# EAGLE design placa_nano (EAGLE 7.7.0)
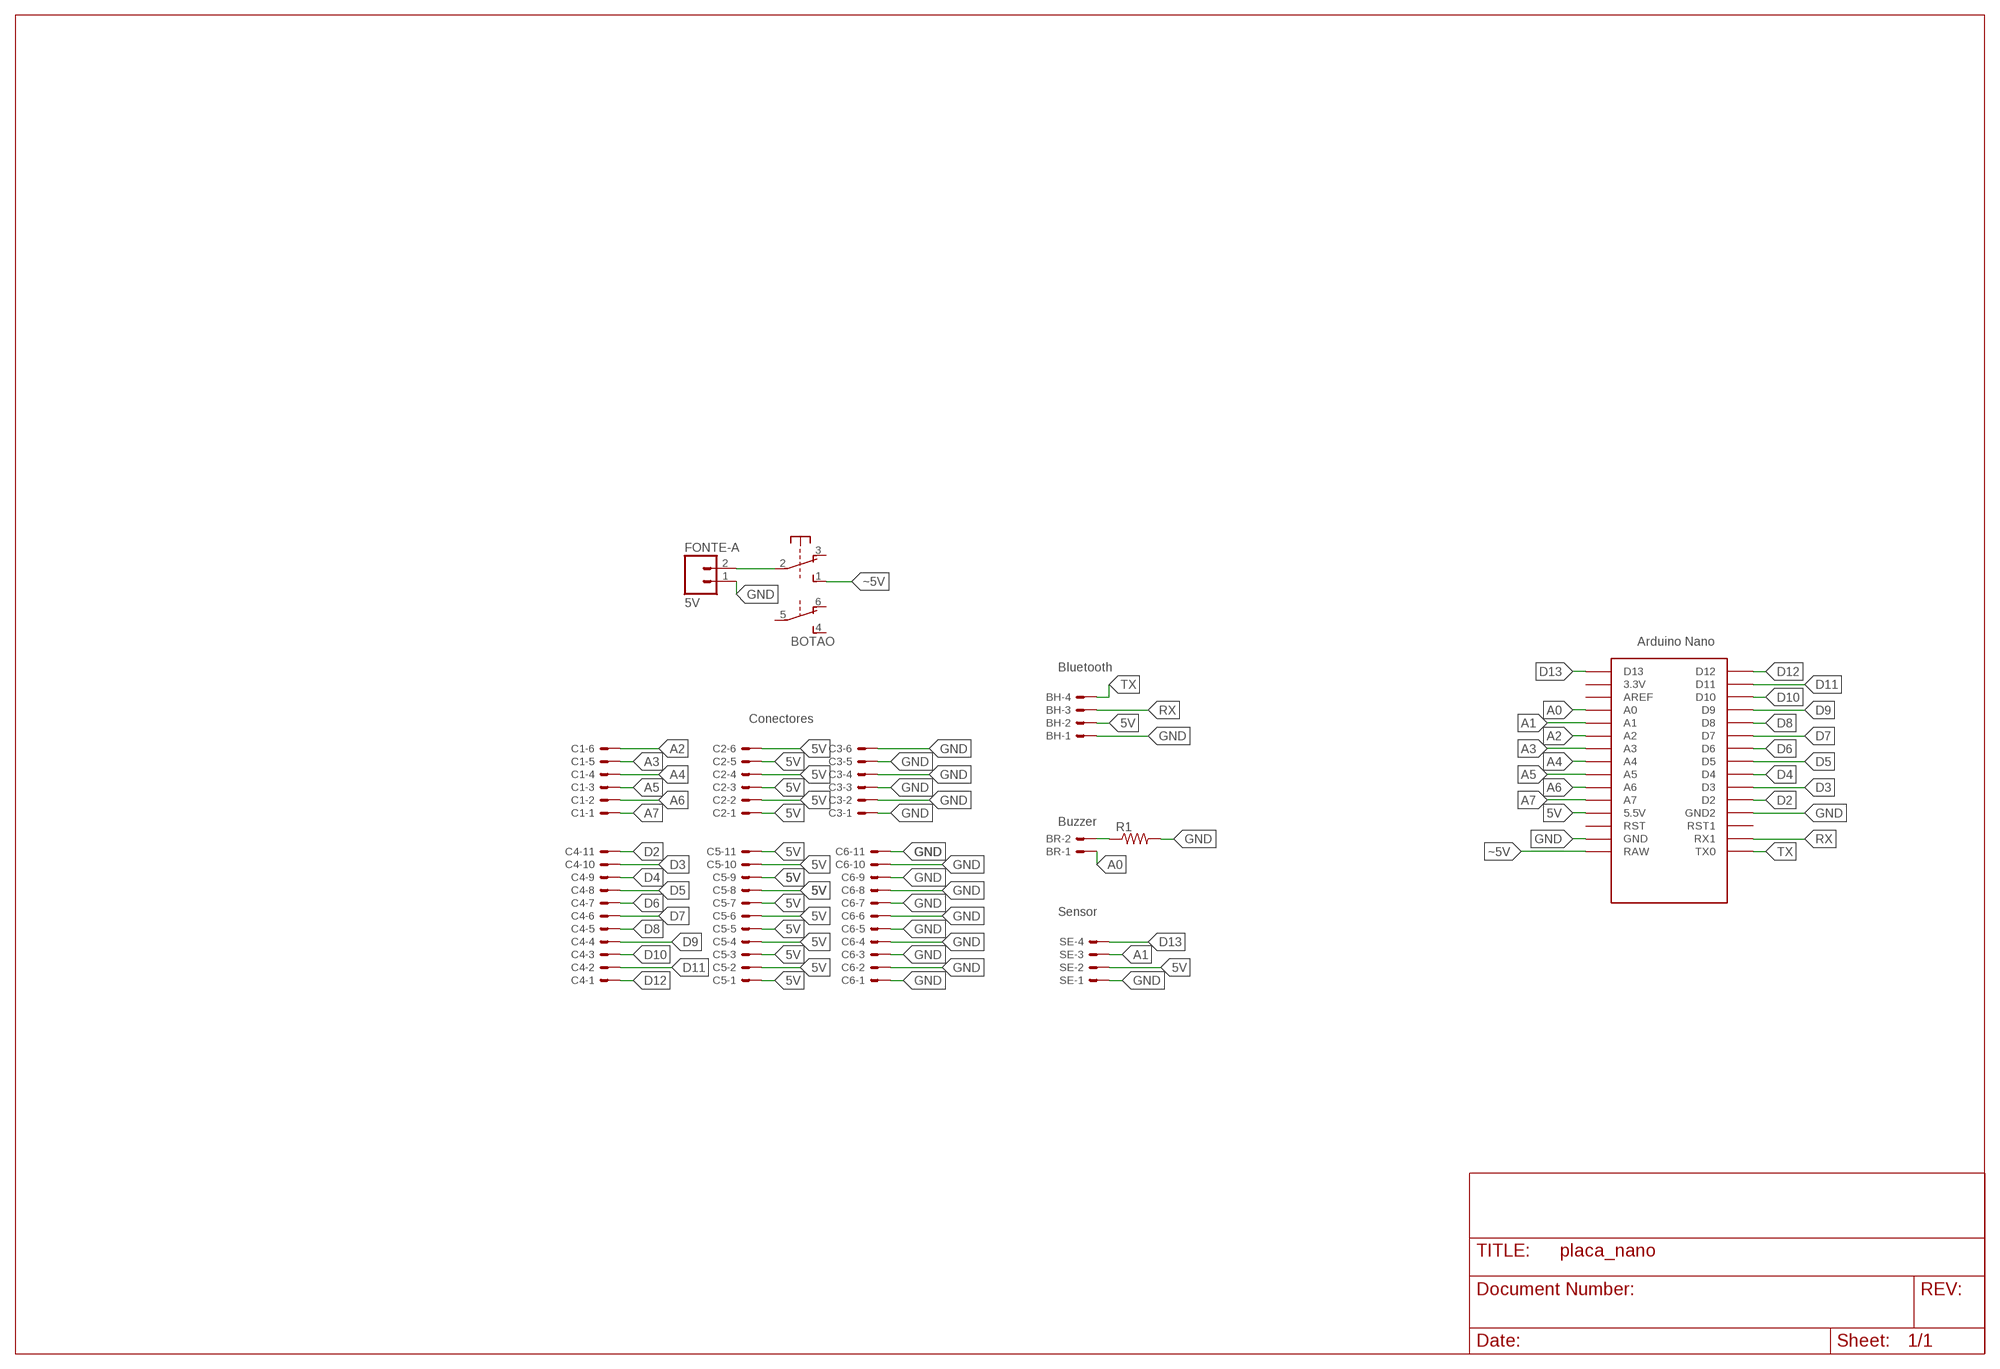
[diagram p0: schematic, sheet 1]

## Parts
BH  22-23-2041  [22-23-2041]
BOTAO  9077-2  [9077-2]
BR  22-23-2021  [22-23-2021]
C1  22-23-2061  [22-23-2061]
C2  22-23-2061  [22-23-2061]
C3  22-23-2061  [22-23-2061]
C4  22-23-2111  [22-23-2111]
C5  22-23-2111  [22-23-2111]
C6  22-23-2111  [22-23-2111]
FONTE-A  5V  M02  [02P]
R1  R-US_0207/10  [0207/10]
SE  22-23-2041  [22-23-2041]
U$1  NANO  [NANO]

## Nets
5V: BH.2 C2.1 C2.2 C2.3 C2.4 C2.5 C2.6 C5.1 C5.2 C5.3 C5.4 C5.5 C5.6 C5.7 C5.8 C5.9 C5.10 C5.11 SE.2 U$1.5V(5.5V)
A0: BR.1 U$1.A0
A1: SE.3 U$1.A1
A2: C1.6 U$1.A2
A3: C1.5 U$1.A3
A4: C1.4 U$1.A4
A5: C1.3 U$1.A5
A6: C1.2 U$1.A6
A7: C1.1 U$1.A7
D2: C4.11 U$1.D2
D3: C4.10 U$1.D3
D4: C4.9 U$1.D4
D5: C4.8 U$1.D5
D6: C4.7 U$1.D6
D7: C4.6 U$1.D7
D8: C4.5 U$1.D8
D9: C4.4 U$1.D9
D10: C4.3 U$1.D10
D11: C4.2 U$1.D11
D12: C4.1 U$1.D12
D13: SE.4 U$1.D13
GND: BH.1 C3.1 C3.2 C3.3 C3.4 C3.5 C3.6 C6.1 C6.2 C6.3 C6.4 C6.5 C6.6 C6.7 C6.8 C6.9 C6.10 C6.11 FONTE-A.1 R1.2 SE.1 U$1.GND U$1.GND1(GND2)
N$4: BR.2 R1.1
RX: BH.3 U$1.RX1
TX: BH.4 U$1.TX0
~5V: BOTAO.1(1:S) BOTAO.2(1:P) FONTE-A.2 U$1.RAW
Unconnected: BOTAO.3(1:O) BOTAO.4(2:S) BOTAO.5(2:P) BOTAO.6(2:O) U$1.3.3V U$1.AREF U$1.RST U$1.RST1

## Notes on the sheet
- Bluetooth
- Conectores
- Buzzer
- Sensor

## Library data of the parts
BH SE = con-molex:22-23-2041: .100" (2.54mm) Center Header - 4 Pin; MF: MOLEX; MPN: 22-23-2041; OC_FARNELL: 1462920; OC_NEWARK: 38C0355
BOTAO = switch-misc:9077-2: MARQUARDT SWITCH 9077.0200 Distributor: Buerklin <https://www.buerklin.com/default.asp?event=ShowArtikel%2812G2822%29&l=d&jump=ArtNr_12G2822>
BR = con-molex:22-23-2021: .100" (2.54mm) Center Header - 2 Pin; MF: MOLEX; MPN: 22-23-2021; OC_FARNELL: 1462926; OC_NEWARK: 25C3832
C1-C3 = con-molex:22-23-2061: .100" (2.54mm) Center Header - 6 Pin; MF: MOLEX; MPN: 22-23-2061; OC_FARNELL: 1462922; OC_NEWARK: 27C1933
C4-C6 = con-molex:22-23-2111: .100" (2.54mm) Center Header - 11 Pin; MF: MOLEX; MPN: 22-23-2111; OC_FARNELL: 5388879; OC_NEWARK: 27C9916
FONTE-A = con-amp-quick:M02: AMP QUICK CONNECTOR; OC_FARNELL: unknown; OC_NEWARK: unknown
R1 = resistor:R-US_: RESISTOR, American symbol
U$1 = Arduino-clone:NANO: Arduino Nano

## Board
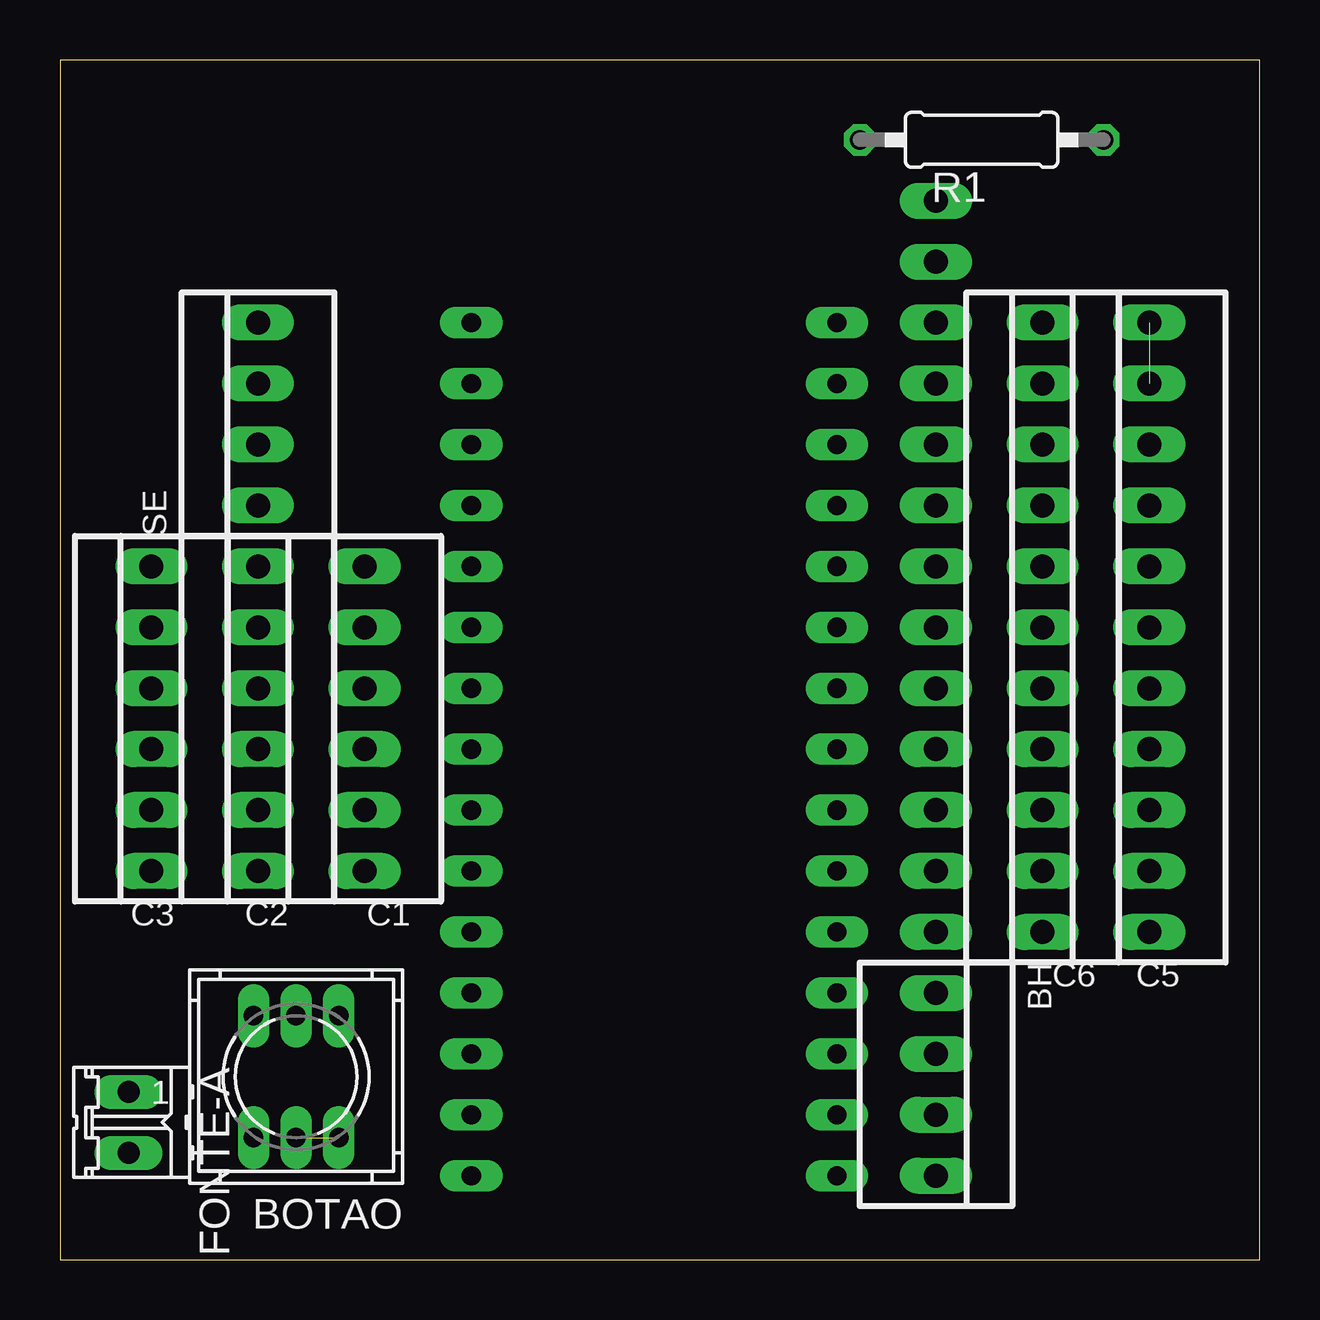
[diagram p1: board, top side]
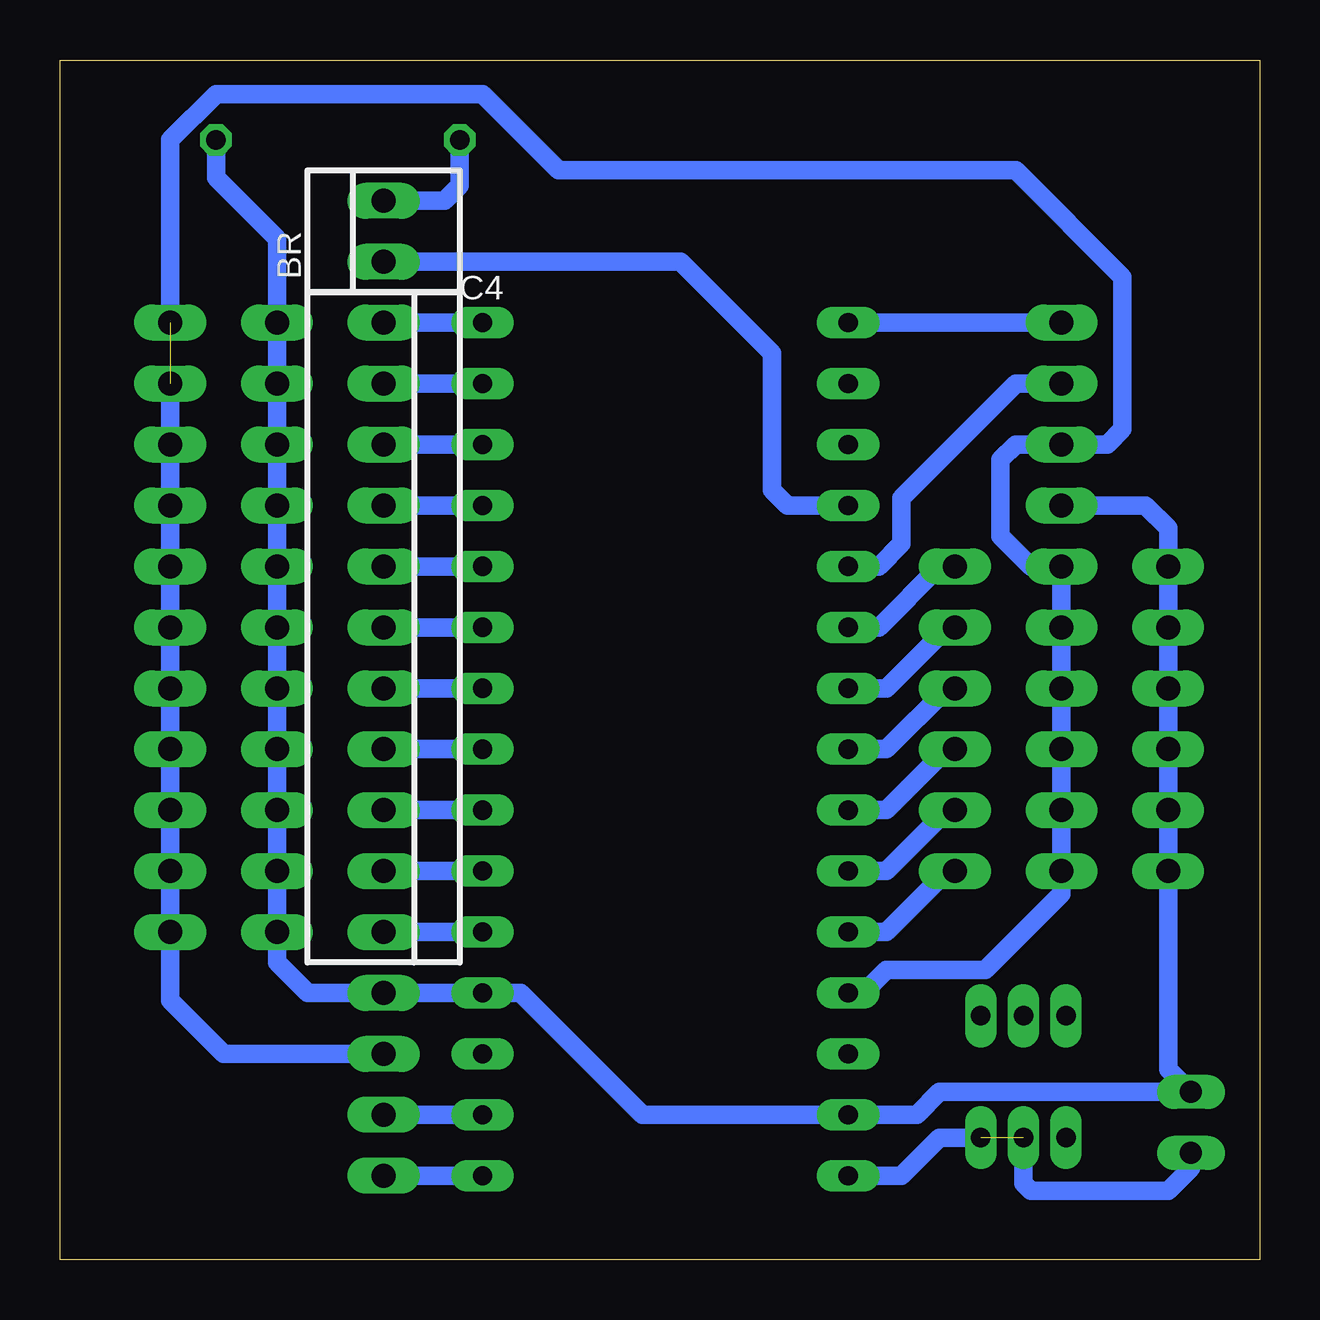
[diagram p2: board, bottom side, seen from below]

Size 50 x 50 mm. Coordinates in mm from the lower left corner, seen from the top.
Outline: 0,0 50,0 50,50 0,50 0,0
Copper layers (1*16): Top 0.035mm / dielectric 1.5mm / Bottom 0.035mm
Design rules "default": minimum track width 10mil, minimum drill 24mil, track to track 8mil, track to pad 8mil, pad to pad 8mil, via to via 8mil, smd to smd 8mil, copper to edge 40mil, drill to drill 8mil, minimum pad ring 10mil, minimum via ring 8mil, stop-mask expansion 4mil, vias tented up to drill 0mil, thermal gap 10mil

### Footprints (pad centres in the part's own frame; a part is rotated, then mirrored left to right if it is on the bottom)
22-23-2041 = drill 1 long: 1 -3.81,0; 2 -1.27,0; 3 1.27,0; 4 3.81,0
9077-2 = drill 0.813 long: 1 -1.778,2.54; 2 0,2.54; 3 1.778,2.54; 4 -1.778,-2.54; 5 0,-2.54; 6 1.778,-2.54
22-23-2021 = drill 1 long: 1 -1.27,0; 2 1.27,0
22-23-2061 = drill 1 long: 1 -6.35,0; 2 -3.81,0; 3 -1.27,0; 4 1.27,0; 5 3.81,0; 6 6.35,0
22-23-2111 = drill 1 long: 1 -12.7,0; 2 -10.16,0; 3 -7.62,0; 4 -5.08,0; 5 -2.54,0; 6 0,0; 7 2.54,0; 8 5.08,0; 9 7.62,0; 10 10.16,0; 11 12.7,0
02P = drill 0.914 long: 1 -1.27,0; 2 1.27,0
0207/10 = drill 0.813 octagon: 1 -5.08,0; 2 5.08,0
NANO = drill 0.8 long: 3.3V -10.16,24.13; 5V -10.16,-1.27; A0 -10.16,19.05; A1 -10.16,16.51; A2 -10.16,13.97; A3 -10.16,11.43; A4 -10.16,8.89; A5 -10.16,6.35; A6 -10.16,3.81; A7 -10.16,1.27; AREF -10.16,21.59; D2 5.08,1.27; D3 5.08,3.81; D4 5.08,6.35; D5 5.08,8.89; D6 5.08,11.43; D7 5.08,13.97; D8 5.08,16.51; D9 5.08,19.05; D10 5.08,21.59; D11 5.08,24.13; D12 5.08,26.67; D13 -10.16,26.67; GND -10.16,-6.35; GND1 5.08,-1.27; RAW -10.16,-8.89; RST -10.16,-3.81; RST1 5.08,-3.81; RX1 5.08,-6.35; TX0 5.08,-8.89

### Placement (x,y rotation side)
BH  36.51,7.3 270 top
BOTAO  9.84,7.62 180 top
BR  36.51,42.86 90 bottom
C1  12.7,22.54 90 top
C2  8.26,22.54 90 top
C3  3.81,22.54 90 top
C4  36.51,26.35 270 bottom
C5  45.4,26.35 90 top
C6  40.96,26.35 90 top
FONTE-A  2.86,5.71 270 top
R1  38.42,46.67 0 top
SE  8.26,35.24 90 top
U$1  27.3,12.38 0 top

### Tracks (layer width: path | path; a pad name or v marks a point on that pad's centre or on a via)
5V  (1 unrouted)
  Bottom 0.762: C5.10 C5.9 C5.8 C5.7 C5.6 C5.5 C5.4 C5.3 C5.2 C5.1 45.4,10.79 43.18,8.57 BH.2 | U$1.5V 16.51,11.11 15.56,12.06 11.43,12.06 8.26,15.24 C2.1 C2.2 C2.3 C2.4 C2.5 C2.6 9.53,28.89 10.79,30.16 10.79,33.34 10.16,33.97 SE.2 6.35,33.97 5.71,34.61 5.71,40.96 10.16,45.4 29.21,45.4 32.38,48.58 43.5,48.58 45.4,46.67 C5.11
A0
  Bottom 0.762: BR.1 24.13,41.59 20.32,37.78 20.32,32.07 19.68,31.43 U$1.A0
A1
  Bottom 0.762: SE.3 10.16,36.51 14.92,31.75 14.92,29.84 15.88,28.89 U$1.A1
A2
  Bottom 0.762: C1.6 13.34,28.89 15.88,26.35 U$1.A2
A3
  Bottom 0.762: C1.5 13.02,26.35 15.56,23.81 U$1.A3
A4
  Bottom 0.762: C1.4 13.02,23.81 15.56,21.27 U$1.A4
A5
  Bottom 0.762: C1.3 13.02,21.27 15.56,18.73 U$1.A5
A6
  Bottom 0.762: C1.2 13.02,18.73 15.56,16.19 U$1.A6
A7
  Bottom 0.762: C1.1 13.02,16.19 15.56,13.65 U$1.A7
D2
  Bottom 0.762: U$1.D2 C4.11
D3
  Bottom 0.762: U$1.D3 C4.10
D4
  Bottom 0.762: U$1.D4 C4.9
D5
  Bottom 0.762: U$1.D5 C4.8
D6
  Bottom 0.762: U$1.D6 C4.7
D7
  Bottom 0.762: U$1.D7 C4.6
D8
  Bottom 0.762: U$1.D8 C4.5
D9
  Bottom 0.762: U$1.D9 C4.4
D10
  Bottom 0.762: U$1.D10 C4.3
D11
  Bottom 0.762: U$1.D11 C4.2
D12
  Bottom 0.762: U$1.D12 C4.1
D13
  Bottom 0.762: SE.4 U$1.D13
GND
  Bottom 0.762: SE.1 4.76,31.43 3.81,30.48 C3.6 C3.5 C3.4 C3.3 C3.2 C3.1 3.81,7.94 FONTE-A.1 13.34,6.99 14.29,6.03 U$1.GND 25.72,6.03 30.8,11.11 U$1.GND1 BH.1 39.69,11.11 40.96,12.38 C6.1 C6.2 C6.3 C6.4 C6.5 C6.6 C6.7 C6.8 C6.9 C6.10 C6.11 40.96,42.55 43.5,45.09 R1.2
N$4
  Bottom 0.762: R1.1 33.34,44.77 33.97,44.13 BR.2
RX
  Bottom 0.762: U$1.RX1 BH.3
TX
  Bottom 0.762: U$1.TX0 BH.4
~5V  (1 unrouted)
  Bottom 0.762: BOTAO.1 13.34,5.08 14.92,3.49 U$1.RAW | BOTAO.2 9.84,3.17 9.53,2.86 3.81,2.86 2.86,3.81 FONTE-A.2